# Altium project DM2097.PrjPcb (part 3 of 6)

## Sheet DM2097_LEFT_OV9282.SchDoc: =project_title
size Tabloid; PageSetup: Record=PageOptions|CenterHorizontal=True|CenterVertical=True|PrintScale=0.71|XCorrection=1.00|YCorrection=1.00|PrintKind=0|BorderSize=5000000|LeftOffset=0|BottomOffset=0|Orientation=2|PaperLength=1000|PaperWidth=1000|Scale=100|PaperSource=7|PrintQuality=-4|MediaType=1|DitherType=10|PrintScaleMode=1|PaperKind=A4; CompanyName: Luxonis Holding; DrawnBy: David Malovrh; Organization: Luxonis Holding; Address1: 1925 Harmony Park Drive; Address2: Westminster, CO; Address3: 80234; Address4: United States; DocumentNumber: D0000200; Revision: R3M1E4; SheetNumber: 5; SheetTotal: 17
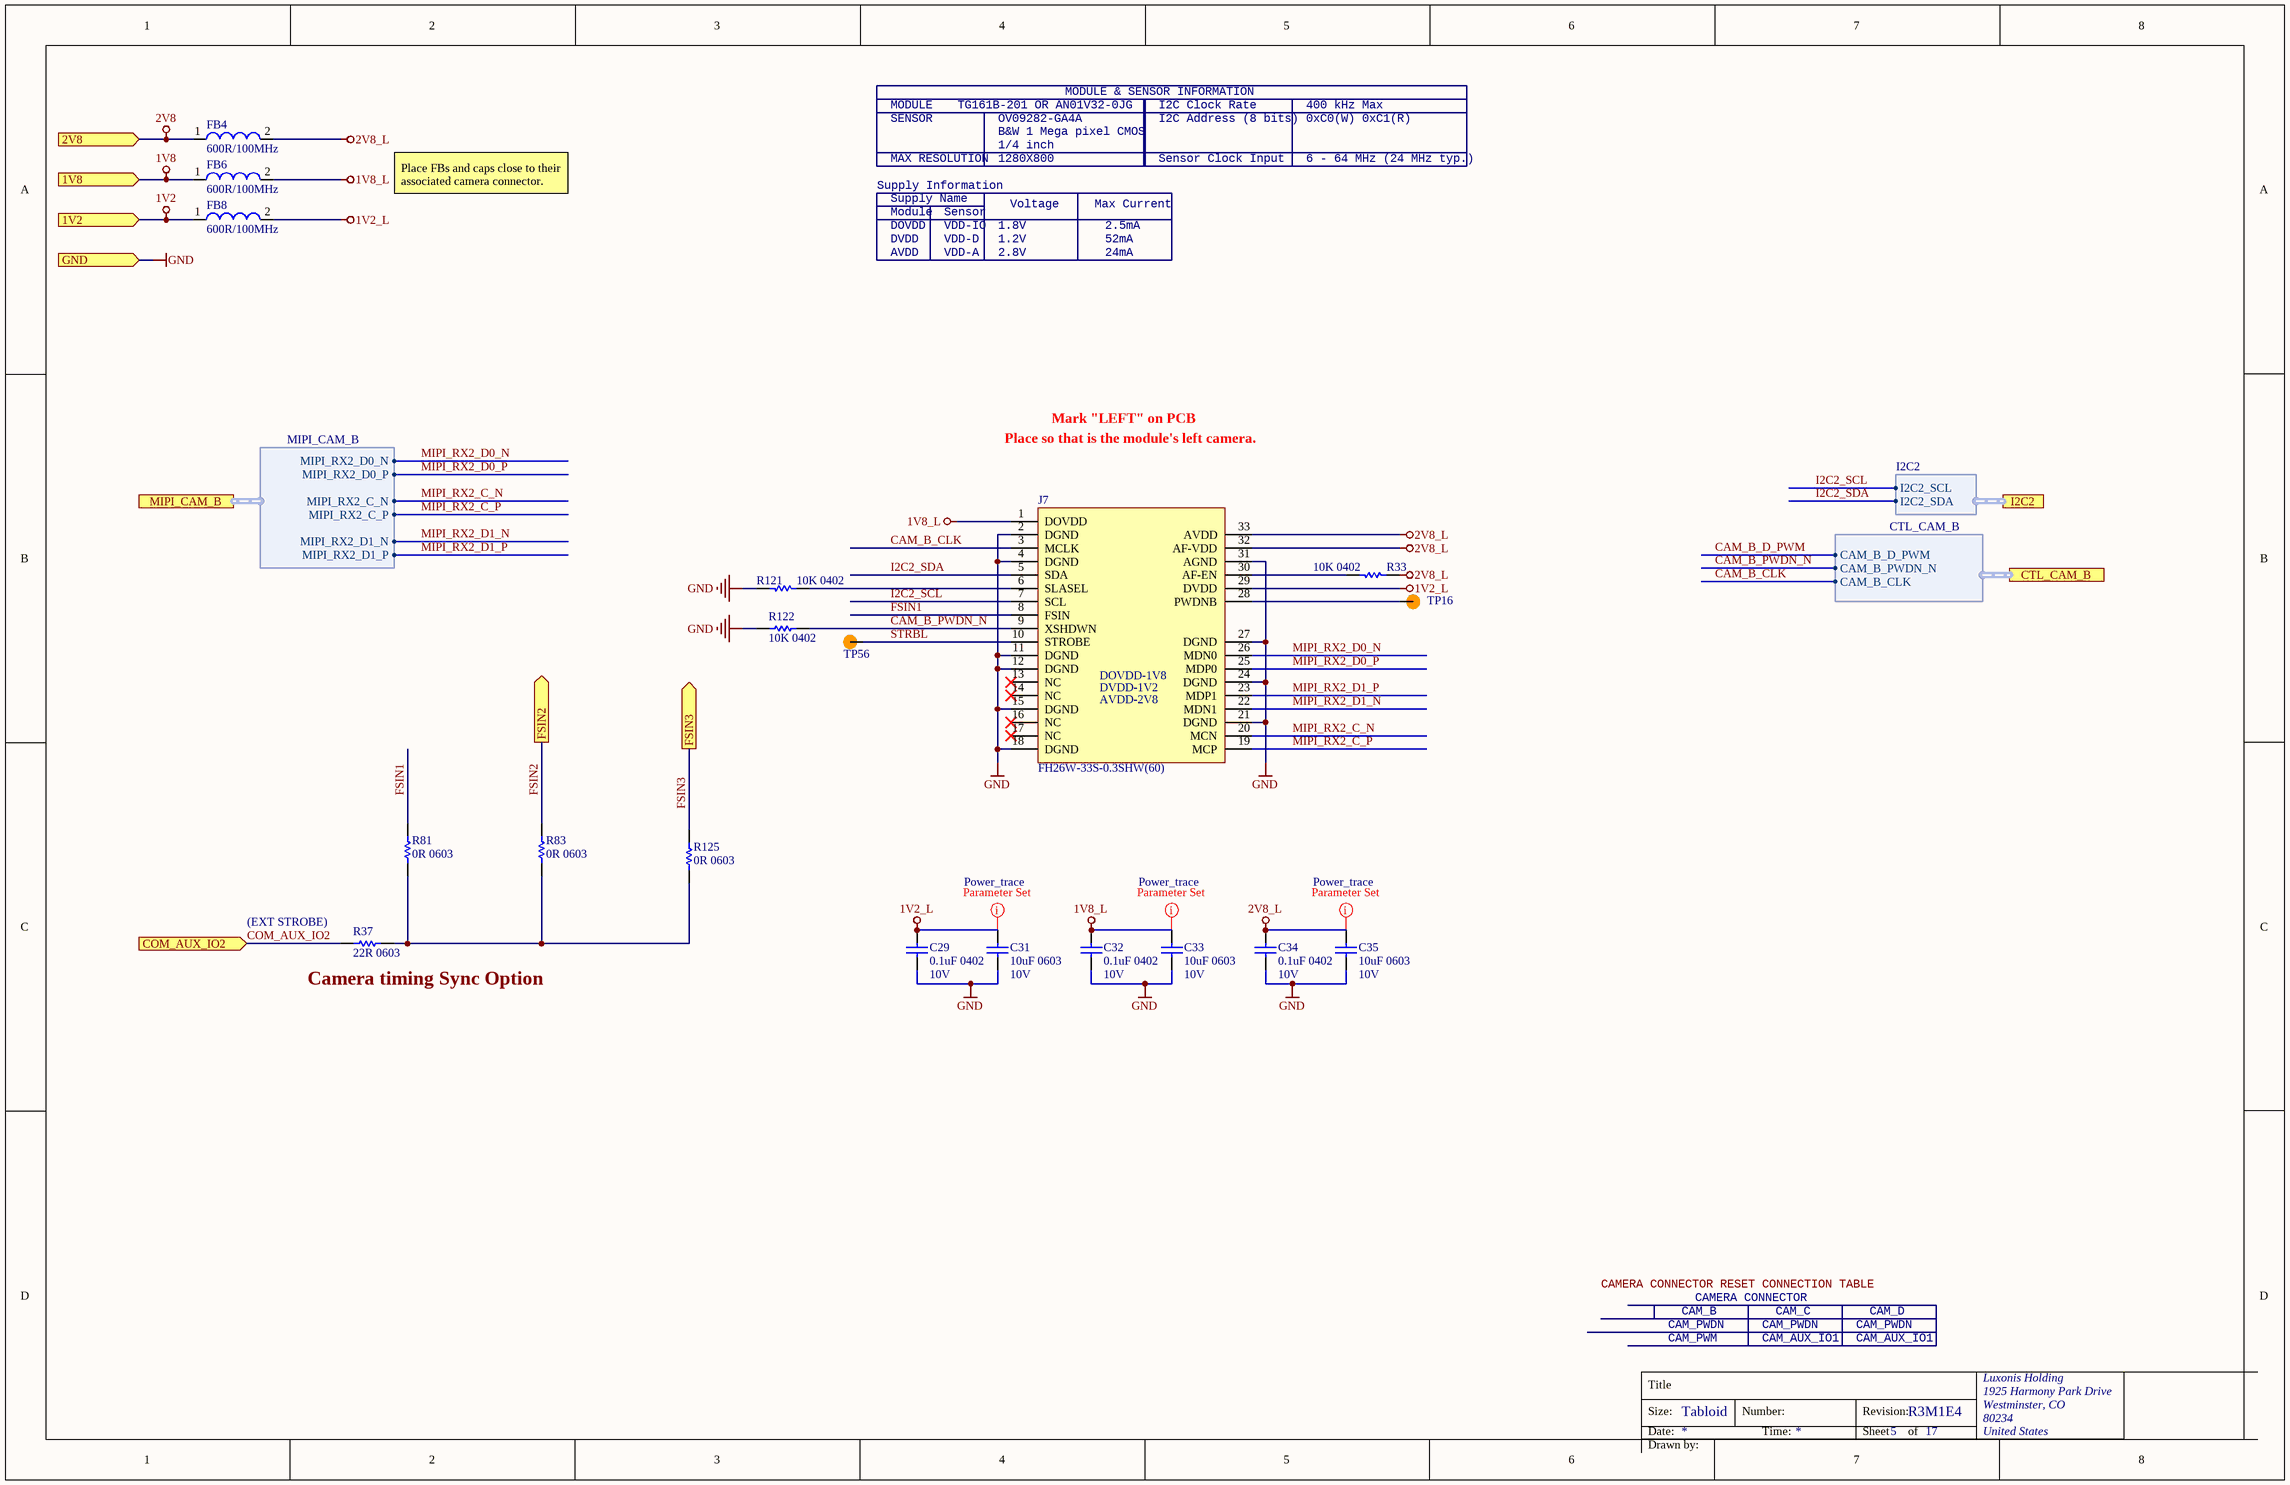
[diagram p3: DM2097_LEFT_OV9282.SchDoc]

### Parts
C29  0.1uF 0402  Voltage Rating: 10V  [CAPC0402(1005)70_N]
C31  10uF 0603  Voltage Rating: 10V  [CAPC0603(1608)100_N]
C32  0.1uF 0402  Voltage Rating: 10V  [CAPC0402(1005)70_N]
C33  10uF 0603  Voltage Rating: 10V  [CAPC0603(1608)100_N]
C34  0.1uF 0402  Voltage Rating: 10V  [CAPC0402(1005)70_N]
C35  10uF 0603  Voltage Rating: 10V  [CAPC0603(1608)100_N]
FB4  600R/100MHz  [2508056017Y2]
FB6  600R/100MHz  [2508056017Y2]
FB8  600R/100MHz  [2508056017Y2]
J7  FH26W-33S-0.3SHW(60)  [AC-PY003-OV9282]
R33  10K 0402  [RESC0402(1005)_L]
R37  22R 0603  [RESC0603(1608)_N]
R81  0R 0603  [RESC0603(1608)_N]
R83  0R 0603  [RESC0603(1608)_N]
R121  10K 0402  [RESC0402(1005)_L]
R122  10K 0402  [RESC0402(1005)_L]
R125  0R 0603  [RESC0603(1608)_N]
TP16  TP100_200_NS  [TP100_200_NS]  (value not drawn)  (no BOM)
TP56  TP100_200_NS  [TP100_200_NS]  (value not drawn)  (no BOM)

### Ports
1V2 (in), 1V8 (in), 2V8 (in), COM_AUX_IO2 (in), CTL_CAM_B (harness CTL_CAM_B), FSIN2 (out), FSIN3 (out), GND (in), I2C2 (harness I2C2), MIPI_CAM_B (harness MIPI_CAM_B)

### Harnesses
I2C2: I2C2_SDA, I2C2_SCL
MIPI_CAM_B: MIPI_RX2_D1_P, MIPI_RX2_D1_N, MIPI_RX2_D0_N, MIPI_RX2_D0_P, MIPI_RX2_C_N, MIPI_RX2_C_P
CTL_CAM_B: CAM_B_CLK, CAM_B_PWDN_N, CAM_B_D_PWM

### Nets
1V2: FB8.1 ; port 1V2
1V2_L: C29.2 C31.2 FB8.2 J7.29(DVDD)
1V8: FB6.1 ; port 1V8
1V8_L: C32.2 C33.2 FB6.2 J7.1(DOVDD)
2V8: FB4.1 ; port 2V8
2V8_L: C34.2 C35.2 FB4.2 J7.32(AF-VDD) J7.33(AVDD) R33.2
GND: C29.1 C31.1 C32.1 C33.1 C34.1 C35.1 J7.2(DGND) J7.4(DGND) J7.11(DGND) J7.12(DGND) J7.15(DGND) J7.18(DGND) J7.21(DGND) J7.24(DGND) J7.27(DGND) J7.31(AGND) R121.1 R122.2 ; port GND
CAM_B_CLK: J7.3(MCLK) ; port CTL_CAM_B.CAM_B_CLK
CAM_B_PWDN_N: J7.9(XSHDWN) R122.1 ; port CTL_CAM_B.CAM_B_PWDN_N
COM_AUX_IO2: R37.1 ; port COM_AUX_IO2
FSIN1: J7.8(FSIN) R81.2
FSIN2: R83.2 ; port FSIN2
FSIN3: R125.2 ; port FSIN3
I2C2_SCL: J7.7(SCL) ; port I2C2.I2C2_SCL
I2C2_SDA: J7.5(SDA) ; port I2C2.I2C2_SDA
MIPI_RX2_C_N: J7.20(MCN) ; port MIPI_CAM_B.MIPI_RX2_C_N
MIPI_RX2_C_P: J7.19(MCP) ; port MIPI_CAM_B.MIPI_RX2_C_P
MIPI_RX2_D0_N: J7.26(MDN0) ; port MIPI_CAM_B.MIPI_RX2_D0_N
MIPI_RX2_D0_P: J7.25(MDP0) ; port MIPI_CAM_B.MIPI_RX2_D0_P
MIPI_RX2_D1_N: J7.22(MDN1) ; port MIPI_CAM_B.MIPI_RX2_D1_N
MIPI_RX2_D1_P: J7.23(MDP1) ; port MIPI_CAM_B.MIPI_RX2_D1_P
STRBL: J7.10(STROBE) TP56.1
NetJ7_6: J7.6(SLASEL) R121.2
NetJ7_28: J7.28(PWDNB) TP16.1
NetJ7_30: J7.30(AF-EN) R33.1
NetR37_2: R37.2 R81.1 R83.1 R125.1

Not connected (* = marked no-connect by the designer): J7 13(NC)* 14(NC)* 16(NC)* 17(NC)*

### Layout directives
net class Power_trace: 1V2_L, 1V8_L, 2V8_L

### Notes on the sheet
- MODULE & SENSOR INFORMATION
- SENSOR
- MODULE
- MAX RESOLUTION
- TG161B-201 OR AN01V32-0JG
- B&W 1 Mega pixel CMOS
- 1280X800
- OV09282-GA4A
- 1/4 inch
- I2C Address (8 bits)
- I2C Clock Rate
- Sensor Clock Input
- 400 kHz Max
- 6 - 64 MHz (24 MHz typ.)
- 0xC0(W) 0xC1(R)
- Place FBs and caps close to their associated camera connector.
- Supply Information
- DOVDD
- Supply Name
- Module
- VDD-IO
- Sensor
- 1.8V
- Voltage
- Max Current
- 2.5mA
- AVDD
- DVDD
- VDD-A
- VDD-D
- 2.8V
- 1.2V
- 24mA
- 52mA
- Mark "LEFT" on PCB
- Place so that is the module's left camera.
- (near R37) (EXT STROBE)
- (near R37) Camera timing Sync Option
- CAMERA CONNECTOR RESET CONNECTION TABLE
- CAMERA CONNECTOR
- CAM_PWDN
- CAM_PWM
- CAM_B
- CAM_AUX_IO1
- CAM_C
- CAM_D
- Title
- Size:
- Date:
- Tabloid
- Number:
- Time:
- Revision:
- Sheet
- of
- Drawn by:
- (in symbol AC_PY003-OV9282_CON) DOVDD-1V8; DVDD-1V2; AVDD-2V8

### Library data of the parts
C29 C32 C34 = GRM155R71A104JA01D: CAP CER 0.1UF 10V X7R 0402 5%; Manufacturer 1: Murata; Capacitance: 100nF; Manufacturer Part Number 1: GRM155R71A104JA01D; Supplier 1: Digi-Key; Stock 1: 1346709; Pricing 1: 1=0.10000, 10=0.02500, 100=0.01130, 500=0.00806, 1000=0.00633, 2500=0.00575, 5000=0.00529 (USD); RoHS: Yes; Mount: Surface Mount; Case/Package: 0402; Case Code (Imperial): 0402; Case Code (Metric): 1005; Min Operating Temperature: -55°C; Max Operating Temperature: 125°C; Tolerance: 5%; Packaging: Tape and Reel; Voltage Rating (DC): 10V; Dielectric: X7R; Package Quantity: 10000; Termination: SMD/SMT; Length: 1mm; Height: 0.5mm; Width: 0.02inch; Thickness: 0.022inch; Depth: 0.5mm; Radiation Hardening: No; Lead Free: Lead Free; ComponentLink1URL: https://datasheet.ciiva.com/5411/product-5411135.pdf?src-supplier=Mouser; ComponentLink1Description: https://datasheet.ciiva.com/5411/product-5411135.pdf?src-supplier=Mouser; ComponentLink2URL: https://datasheet.ciiva.com/11618/c02e-11618821.pdf?src-supplier=Avnet; ComponentLink2Description: https://datasheet.ciiva.com/11618/c02e-11618821.pdf?src-supplier=Avnet; Supplier Part Number 1: 490-10777-1-ND
C31 C33 C35 = GRM188R61A106ME69D: CAP CER 10UF 10V X5R 0603 20%; Manufacturer 1: Murata; Material: Ceramic; Manufacturer Part Number 1: GRM188R61A106ME69D; Supplier 1: Digi-Key; Stock 1: 2873098; Pricing 1: 1=0.21000, 10=0.14100, 100=0.07130, 500=0.04876, 1000=0.04313 (USD); RoHS: Yes; Mount: Surface Mount; Case/Package: 0603; Weight: 0.000222oz; Case Code (Metric): 1608; Case Code (Imperial): 0603; Min Operating Temperature: -55°C; Max Operating Temperature: 85°C; Packaging: Tape and Reel; Tolerance: 20%; Capacitance: 10uF; Dielectric: X5R; Voltage Rating (DC): 10V; Package Quantity: 4000; Termination: SMD/SMT; Length: 1.6mm; Height: 0.8mm; Width: 0.8mm; Thickness: 0.035inch; Depth: 0.8mm; REACH SVHC: Unknown; Lead Free: Lead Free; ComponentLink1URL: http://www.mouser.com/ds/2/281/c02e-2905.pdf?src-supplier=Mouser; ComponentLink1Description: http://www.mouser.com/ds/2/281/c02e-2905.pdf?src-supplier=Mouser; ComponentLink2URL: http://components.arrow.com/part/dataview/0323_06119472?src-supplier=Arrow+Europe; ComponentLink2Description: http://components.arrow.com/part/dataview/0323_06119472?src-supplier=Arrow+Europe; ComponentLink3URL: http://www.farnell.com/datasheets/2048014.pdf?src-supplier=Farnell; ComponentLink3Description: http://www.farnell.com/datasheets/2048014.pdf?src-supplier=Farnell; ComponentLink4URL: http://www.farnell.com/datasheets/1872210.pdf?src-supplier=Farnell; ComponentLink4Description: http://www.farnell.com/datasheets/1872210.pdf?src-supplier=Farnell; ComponentLink5URL: http://search.murata.co.jp/Ceramy/image/img/A01X/G101/ENG/GRM188R61A106ME69-01.pdf?src-supplier=Digi-Key; ComponentLink5Description: http://search.murata.co.jp/Ceramy/image/img/A01X/G101/ENG/GRM188R61A106ME69-01.pdf?src-supplier=Digi-Key; ComponentLink6URL: http://www.farnell.com/datasheets/1872210.pdf?src-supplier=Newark; ComponentLink6Description: http://www.farnell.com/datasheets/1872210.pdf?src-supplier=Newark; ComponentLink7URL: http://www.farnell.com/datasheets/2048014.pdf?src-supplier=Element14; ComponentLink7Description: http://www.farnell.com/datasheets/2048014.pdf?src-supplier=Element14; ComponentLink8URL: http://www.farnell.com/datasheets/2048014.pdf?src-supplier=Newark; ComponentLink8Description: http://www.farnell.com/datasheets/2048014.pdf?src-supplier=Newark; Supplier Part Number 1: 490-10475-1-ND
FB4 FB6 FB8 = 2508056017Y2: FERRITE BEAD, 0.1OHM, 2A, 0805, 600R/100MHz; Manufacturer 1: Fair-Rite; Impedance: 600R; Tolerance: 25%; Resistance: 350mR; DC Resistance (DCR): 100mR; Test Frequency: 100MHz; Manufacturer Part Number 1: 2508056017Y2; Supplier 1: Digi-Key; Stock 1: 100491; Pricing 1: 1=0.10000, 10=0.07900, 25=0.07120, 50=0.05240, 100=0.04520, 250=0.03568, 500=0.03014, 1000=0.02538 (USD); RoHS: Yes; Case/Package: 0805; Number of Pins: 2; Case Code (Metric): 2012; Case Code (Imperial): 0805; Min Operating Temperature: -55°C; Max Operating Temperature: 125°C; Package Quantity: 4000; Packaging: Tape and Reel; Max DC Current: 2A; Termination: SMD/SMT; Military Standard: Not; DC Current: 2A; Current Rating: 2A; Frequency: 100MHz; Length: 2mm; Height: 0.9mm; Width: 1.25mm; Depth: 1.25mm; Radiation Hardening: No; REACH SVHC: No SVHC; ComponentLink1URL: https://datasheet.ciiva.com/3854/3802508056017y2-3854245.pdf?src-supplier=Arrow; ComponentLink1Description: https://datasheet.ciiva.com/3854/3802508056017y2-3854245.pdf?src-supplier=Arrow; ComponentLink2URL: https://datasheet.ciiva.com/22735/652149-22735047.pdf?src-supplier=Element14; ComponentLink2Description: https://datasheet.ciiva.com/22735/652149-22735047.pdf?src-supplier=Element14; ComponentLink3URL: https://datasheet.ciiva.com/1127/26143-1127514.pdf?src-supplier=Farnell; ComponentLink3Description: https://datasheet.ciiva.com/1127/26143-1127514.pdf?src-supplier=Farnell; ComponentLink4URL: https://datasheet.ciiva.com/18090/getdatasheetpartid-212640-18090187.pdf?src-supplier=Verical; ComponentLink4Description: https://datasheet.ciiva.com/18090/getdatasheetpartid-212640-18090187.pdf?src-supplier=Verical; ComponentLink5URL: https://datasheet.ciiva.com/7620/26143-7620140.pdf?src-supplier=Element14; ComponentLink5Description: https://datasheet.ciiva.com/7620/26143-7620140.pdf?src-supplier=Element14; Supplier Part Number 1: 1934-1487-1-ND
J7 = AC_PY003-OV9282_CON: FFC/FPC Connector, 33 Contact(s), 1 Row(s), Female, Right Angle, Surface Mount Terminal; Manufacturer 1: Hirose; Supplier 1: Digi-Key; Manufacturer Part Number 1: FH26W-33S-0.3SHW(60); RoHS: Yes; Category: FFC / FPC; Stock 1: 627; Pricing 1: 1=1,78000, 10=1,61700, 25=1,51800, 50=1,45200, 100=1,38600, 250=1,25400, 500=1,15500, 1000=0,99000, 2500=0,92400 (USD); ComponentLink1URL: https://datasheet.ciiva.com:443/pdfs/VipMasterIC/IC/HIRO/HIRO-S-A0007913874/HIRO-S-A0008593114-1.pdf?src-supplier=IHS+Markit; ComponentLink1Description: https://datasheet.ciiva.com:443/pdfs/VipMasterIC/IC/HIRO/HIRO-S-A0007913874/HIRO-S-A0008593114-1.pdf?src-supplier=IHS+Markit; ComponentLink2URL: https://www.hirose.com/product/en/download_file/key_name/FH26/category/Catalog/doc_file_id/49355/?file_category_id=4&item_id=298&is_series=1&src-supplier=Digi-Key; ComponentLink2Description: https://www.hirose.com/product/en/download_file/key_name/FH26/category/Catalog/doc_file_id/49355/?file_category_id=4&item_id=298&is_series=1&src-supplier=Digi-Key; ComponentLink3URL: https://www.hirose.com/product/download/?distributor=digikey&amp;type=2d&amp;lang=en&amp;num=FH26W-13S-0.3SHW(60)&src-supplier=Digi-Key; ComponentLink3Description: https://www.hirose.com/product/download/?distributor=digikey&amp;type=2d&amp;lang=en&amp;num=FH26W-13S-0.3SHW(60)&src-supplier=Digi-Key; Supplier Part Number 1: H125800CT-ND
R33 R121 R122 = RC0402FR-1310KL: RES SMD 10K OHM 1% 0402 1/16W Chip Resistor, 0402 [1005 Metric], 10 kohm, RC Series, 50 V, Thick Film, 62.5 mW; Manufacturer 1: Yageo; Resistance: 10kR; Temperature Coefficient: 100ppm/°C; Power Rating: 62.5mW; Voltage Rating: 50V; ComponentLink1URL: https://datasheet.ciiva.com/16940/pyu-rc0402-51-rohs-l-6-16940293.pdf?src-supplier=Avnet+Europe; ComponentLink1Description: https://datasheet.ciiva.com/16940/pyu-rc0402-51-rohs-l-6-16940293.pdf?src-supplier=Avnet+Europe; ComponentLink2URL: https://datasheet.ciiva.com/28386/pyu-rc0402-51-rohs-l-6-28386855.pdf?src-supplier=Avnet+Europe; ComponentLink2Description: https://datasheet.ciiva.com/28386/pyu-rc0402-51-rohs-l-6-28386855.pdf?src-supplier=Avnet+Europe; ComponentLink3URL: https://datasheet.ciiva.com/16740/pyu-rc0402-51-rohs-l-6-r-16740602.pdf?src-supplier=Future+Electronics; ComponentLink3Description: https://datasheet.ciiva.com/16740/pyu-rc0402-51-rohs-l-6-r-16740602.pdf?src-supplier=Future+Electronics; ComponentLink4URL: https://datasheet.ciiva.com/8891/pyu-rc0402-51-rohs-l-6-8891339.pdf?src-supplier=Avnet; ComponentLink4Description: https://datasheet.ciiva.com/8891/pyu-rc0402-51-rohs-l-6-8891339.pdf?src-supplier=Avnet; ComponentLink5URL: https://datasheet.ciiva.com/5557/pyu-rc0402-51-rohs-l-6-r-5557997.pdf?src-supplier=Mouser; ComponentLink5Description: https://datasheet.ciiva.com/5557/pyu-rc0402-51-rohs-l-6-r-5557997.pdf?src-supplier=Mouser; ComponentLink6URL: https://datasheet.ciiva.com/7983/1018594-7983533.pdf?src-supplier=Element14; ComponentLink6Description: https://datasheet.ciiva.com/7983/1018594-7983533.pdf?src-supplier=Element14; Supplier 1: Newark; Manufacturer Part Number 1: RC0402FR-1310KL; Stock 1: 62239; Pricing 1: 1=0.10000, 25=0.01200, 100=0.00400, 250=0.00400, 500=0.00300, 1000=0.00300 (USD); RoHS: Yes; Case/Package: 0402; Number of Pins: 2; Contact Plating: Tin,Matte,Lead; Case Code (Imperial): 0402; Case Code (Metric): 1005; Min Operating Temperature: -55°C; Max Operating Temperature: 155°C; Tolerance: 1%; Composition: Thick Film; Packaging: Tape and Reel; Termination: SMD/SMT; Military Standard: Not; Voltage Rating (DC): 50V; Working Voltage: 50V; Number of Terminations: 2; Length: 1mm; Depth: 0.5mm; Radiation Hardening: No; REACH SVHC: No SVHC; Lead Free: Lead Free; Supplier Part Number 1: 67R9960; Supplier 2: Future Electronics; Supplier 3: Mouser; Supplier 4: Element14; Supplier Part Number 2: RC0402FR-1310KL-CUTT; Supplier Part Number 3: 603-RC0402FR-1310KL; Supplier Part Number 4: 1799235
R37 = RC0603FR-0722RL: RES SMD 22 OHM 1% 1/10W 0603; Manufacturer 1: Yageo; Temperature Coefficient: 100ppm/°C; Power Rating: 100mW; Voltage Rating: 50V; Supplier 1: Digi-Key; Manufacturer Part Number 1: RC0603FR-0722RL; Stock 1: 3640176; Pricing 1: 1=0.10000, 10=0.02300, 100=0.00940, 1000=0.00421, 2500=0.00366 (USD); RoHS: Yes; Case/Package: 0603; Number of Pins: 2; Case Code (Metric): 1608; Case Code (Imperial): 0603; Min Operating Temperature: -55°C; Max Operating Temperature: 155°C; Tolerance: 1%; Resistance: 22R; Packaging: Tape and Reel; Composition: Thick Film; Voltage Rating (DC): 50V; Package Quantity: 1; Termination: SMD/SMT; Military Standard: Not; Number of Terminations: 2; Max Power Dissipation: 100mW; Features: Moisture Resistant; Length: 1.6mm; Height: 0.022inch; Width: 0.031inch; Depth: 0.8mm; REACH SVHC: No SVHC; Lead Free: Lead Free; ComponentLink1URL: https://datasheet.ciiva.com/11819/0900766b80f96399-11819285.pdf?src-supplier=RSComponents; ComponentLink1Description: https://datasheet.ciiva.com/11819/0900766b80f96399-11819285.pdf?src-supplier=RSComponents; ComponentLink2URL: https://datasheet.ciiva.com/2454/pyu-r-int-thick-7-2454354.pdf?src-supplier=Digi-Key; ComponentLink2Description: https://datasheet.ciiva.com/2454/pyu-r-int-thick-7-2454354.pdf?src-supplier=Digi-Key; ComponentLink3URL: https://datasheet.ciiva.com/2454/pyu-r-int-thick-7-2454355.pdf?src-supplier=Digi-Key; ComponentLink3Description: https://datasheet.ciiva.com/2454/pyu-r-int-thick-7-2454355.pdf?src-supplier=Digi-Key; ComponentLink4URL: https://datasheet.ciiva.com/2454/pyu-r-int-thick-7-2454356.pdf?src-supplier=Digi-Key; ComponentLink4Description: https://datasheet.ciiva.com/2454/pyu-r-int-thick-7-2454356.pdf?src-supplier=Digi-Key; ComponentLink5URL: https://datasheet.ciiva.com/46440/1868787-46440901.pdf?src-supplier=Element14; ComponentLink5Description: https://datasheet.ciiva.com/46440/1868787-46440901.pdf?src-supplier=Element14; ComponentLink6URL: https://datasheet.ciiva.com/46395/443971-46395032.pdf?src-supplier=Element14; ComponentLink6Description: https://datasheet.ciiva.com/46395/443971-46395032.pdf?src-supplier=Element14; Supplier 2: Newark; Supplier 3: Mouser; Supplier Part Number 2: 26M6754; Supplier Part Number 3: 603-RC0603FR-0722RL; Supplier Part Number 1: 311-22.0HRCT-ND
R81 R83 R125 = CRCW06030000Z0EA: RES SMD 0 OHM JUMPER 1/10W 0603 0 Ohms Jumper 0.1W, 1/10W Chip Resistor 0603 (1608 Metric) Automotive AEC-Q200 Thick Film; Manufacturer 1: Vishay; Manufacturer Part Number 1: CRCW0603-0000Z0EA; Resistance: 0mR; Power Rating: 100mW; Voltage Rating: 75V; Temperature Coefficient: 100ppm/°C; Tolerance: 5%; Current Rating: 2A; Supplier 1: Digi-Key; Stock 1: 742743; Pricing 1: 1=0.100000, 10=0.034000, 25=0.024400, 50=0.018600, 100=0.013800, 250=0.010480, 500=0.008400, 1000=0.006180 (USD); RoHS: Yes; Mount: Surface Mount; Case/Package: 0603; Weight: 7.1E-05oz; Contact Plating: Tin,Lead; Case Code (Metric): 1608; Case Code (Imperial): 0603; Min Operating Temperature: -55°C; Max Operating Temperature: 155°C; Composition: Thick Film; Termination: SMD/SMT; Packaging: Tape and Reel; Package Quantity: 1; Number of Terminations: 2; Military Standard: Not; Max Power Dissipation: 100mW; Voltage Rating (DC): 75V; Features: Automotive AEC-Q200; Working Voltage: 75V; Length: 1.55mm; Height: 0.02inch; Width: 0.033inch; Depth: 0.85mm; Radiation Hardening: No; Lead Free: Lead Free; REACH SVHC: Unknown; ComponentLink1URL: https://datasheet.ciiva.com/2461/dcrcwe3-2461968.pdf?src-supplier=Digi-Key; ComponentLink1Description: https://datasheet.ciiva.com/2461/dcrcwe3-2461968.pdf?src-supplier=Digi-Key; ComponentLink2URL: https://datasheet.ciiva.com/2461/dcrcwe3-2461969.pdf?src-supplier=Digi-Key; ComponentLink2Description: https://datasheet.ciiva.com/2461/dcrcwe3-2461969.pdf?src-supplier=Digi-Key; ComponentLink3URL: https://datasheet.ciiva.com/2461/dcrcwe3-2461970.pdf?src-supplier=Digi-Key; ComponentLink3Description: https://datasheet.ciiva.com/2461/dcrcwe3-2461970.pdf?src-supplier=Digi-Key; ComponentLink4URL: https://datasheet.ciiva.com/8340/dcrcwe3-8340197.pdf?src-supplier=Avnet; ComponentLink4Description: https://datasheet.ciiva.com/8340/dcrcwe3-8340197.pdf?src-supplier=Avnet; ComponentLink5URL: https://datasheet.ciiva.com/16941/dcrcw-16941302.pdf?src-supplier=Avnet+Europe; ComponentLink5Description: https://datasheet.ciiva.com/16941/dcrcw-16941302.pdf?src-supplier=Avnet+Europe; ComponentLink6URL: https://datasheet.ciiva.com/16199/dcrcwe3-16199063.pdf?src-supplier=Future+Electronics; ComponentLink6Description: https://datasheet.ciiva.com/16199/dcrcwe3-16199063.pdf?src-supplier=Future+Electronics; ComponentLink7URL: https://datasheet.ciiva.com/16725/70201119-16725175.pdf?src-supplier=Allied+Electronics; ComponentLink7Description: https://datasheet.ciiva.com/16725/70201119-16725175.pdf?src-supplier=Allied+Electronics; ComponentLink8URL: https://datasheet.ciiva.com/26316/fld-crcw-e3-data-en-26316615.pdf?src-supplier=Distrelec; ComponentLink8Description: https://datasheet.ciiva.com/26316/fld-crcw-e3-data-en-26316615.pdf?src-supplier=Distrelec; ComponentLink9URL: https://datasheet.ciiva.com/5544/dcrcwe3-109170-5544344.pdf?src-supplier=Mouser; ComponentLink9Description: https://datasheet.ciiva.com/5544/dcrcwe3-109170-5544344.pdf?src-supplier=Mouser; ComponentLink10URL: https://datasheet.ciiva.com/7841/1720486-7841816.pdf?src-supplier=Element14; ComponentLink10Description: https://datasheet.ciiva.com/7841/1720486-7841816.pdf?src-supplier=Element14; ComponentLink11URL: https://datasheet.ciiva.com/7841/1720486-7841817.pdf?src-supplier=Element14; ComponentLink11Description: https://datasheet.ciiva.com/7841/1720486-7841817.pdf?src-supplier=Element14; ComponentLink12URL: https://datasheet.ciiva.com/7841/125364-7841818.pdf?src-supplier=Element14; ComponentLink12Description: https://datasheet.ciiva.com/7841/125364-7841818.pdf?src-supplier=Element14; ComponentLink13URL: https://datasheet.ciiva.com/16721/70201119-16721450.pdf?src-supplier=Allied+Electronics; ComponentLink13Description: https://datasheet.ciiva.com/16721/70201119-16721450.pdf?src-supplier=Allied+Electronics; Supplier Part Number 1: 541-0.0GCT-ND
TP16 TP56 = TEST_POINT

## Sheet DM2097_Power_Supply.SchDoc: =project_title
size Tabloid; PageSetup: Record=PageOptions|CenterHorizontal=True|CenterVertical=True|PrintScale=0.73|XCorrection=1.00|YCorrection=1.00|PrintKind=0|BorderSize=5000000|LeftOffset=0|BottomOffset=0|Orientation=2|PaperLength=1000|PaperWidth=1000|Scale=100|PaperSource=7|PrintQuality=-4|MediaType=1|DitherType=10|PaperKind=A4|PrintScaleMode=1; CompanyName: Luxonis Holding; DrawnBy: David Malovrh; Organization: Luxonis Holding; Address1: 1925 Harmony Park Drive; Address2: Westminster, CO; Address3: 80234; Address4: United States; DocumentNumber: D0000200; Revision: R3M1E4; SheetNumber: 7; SheetTotal: 17
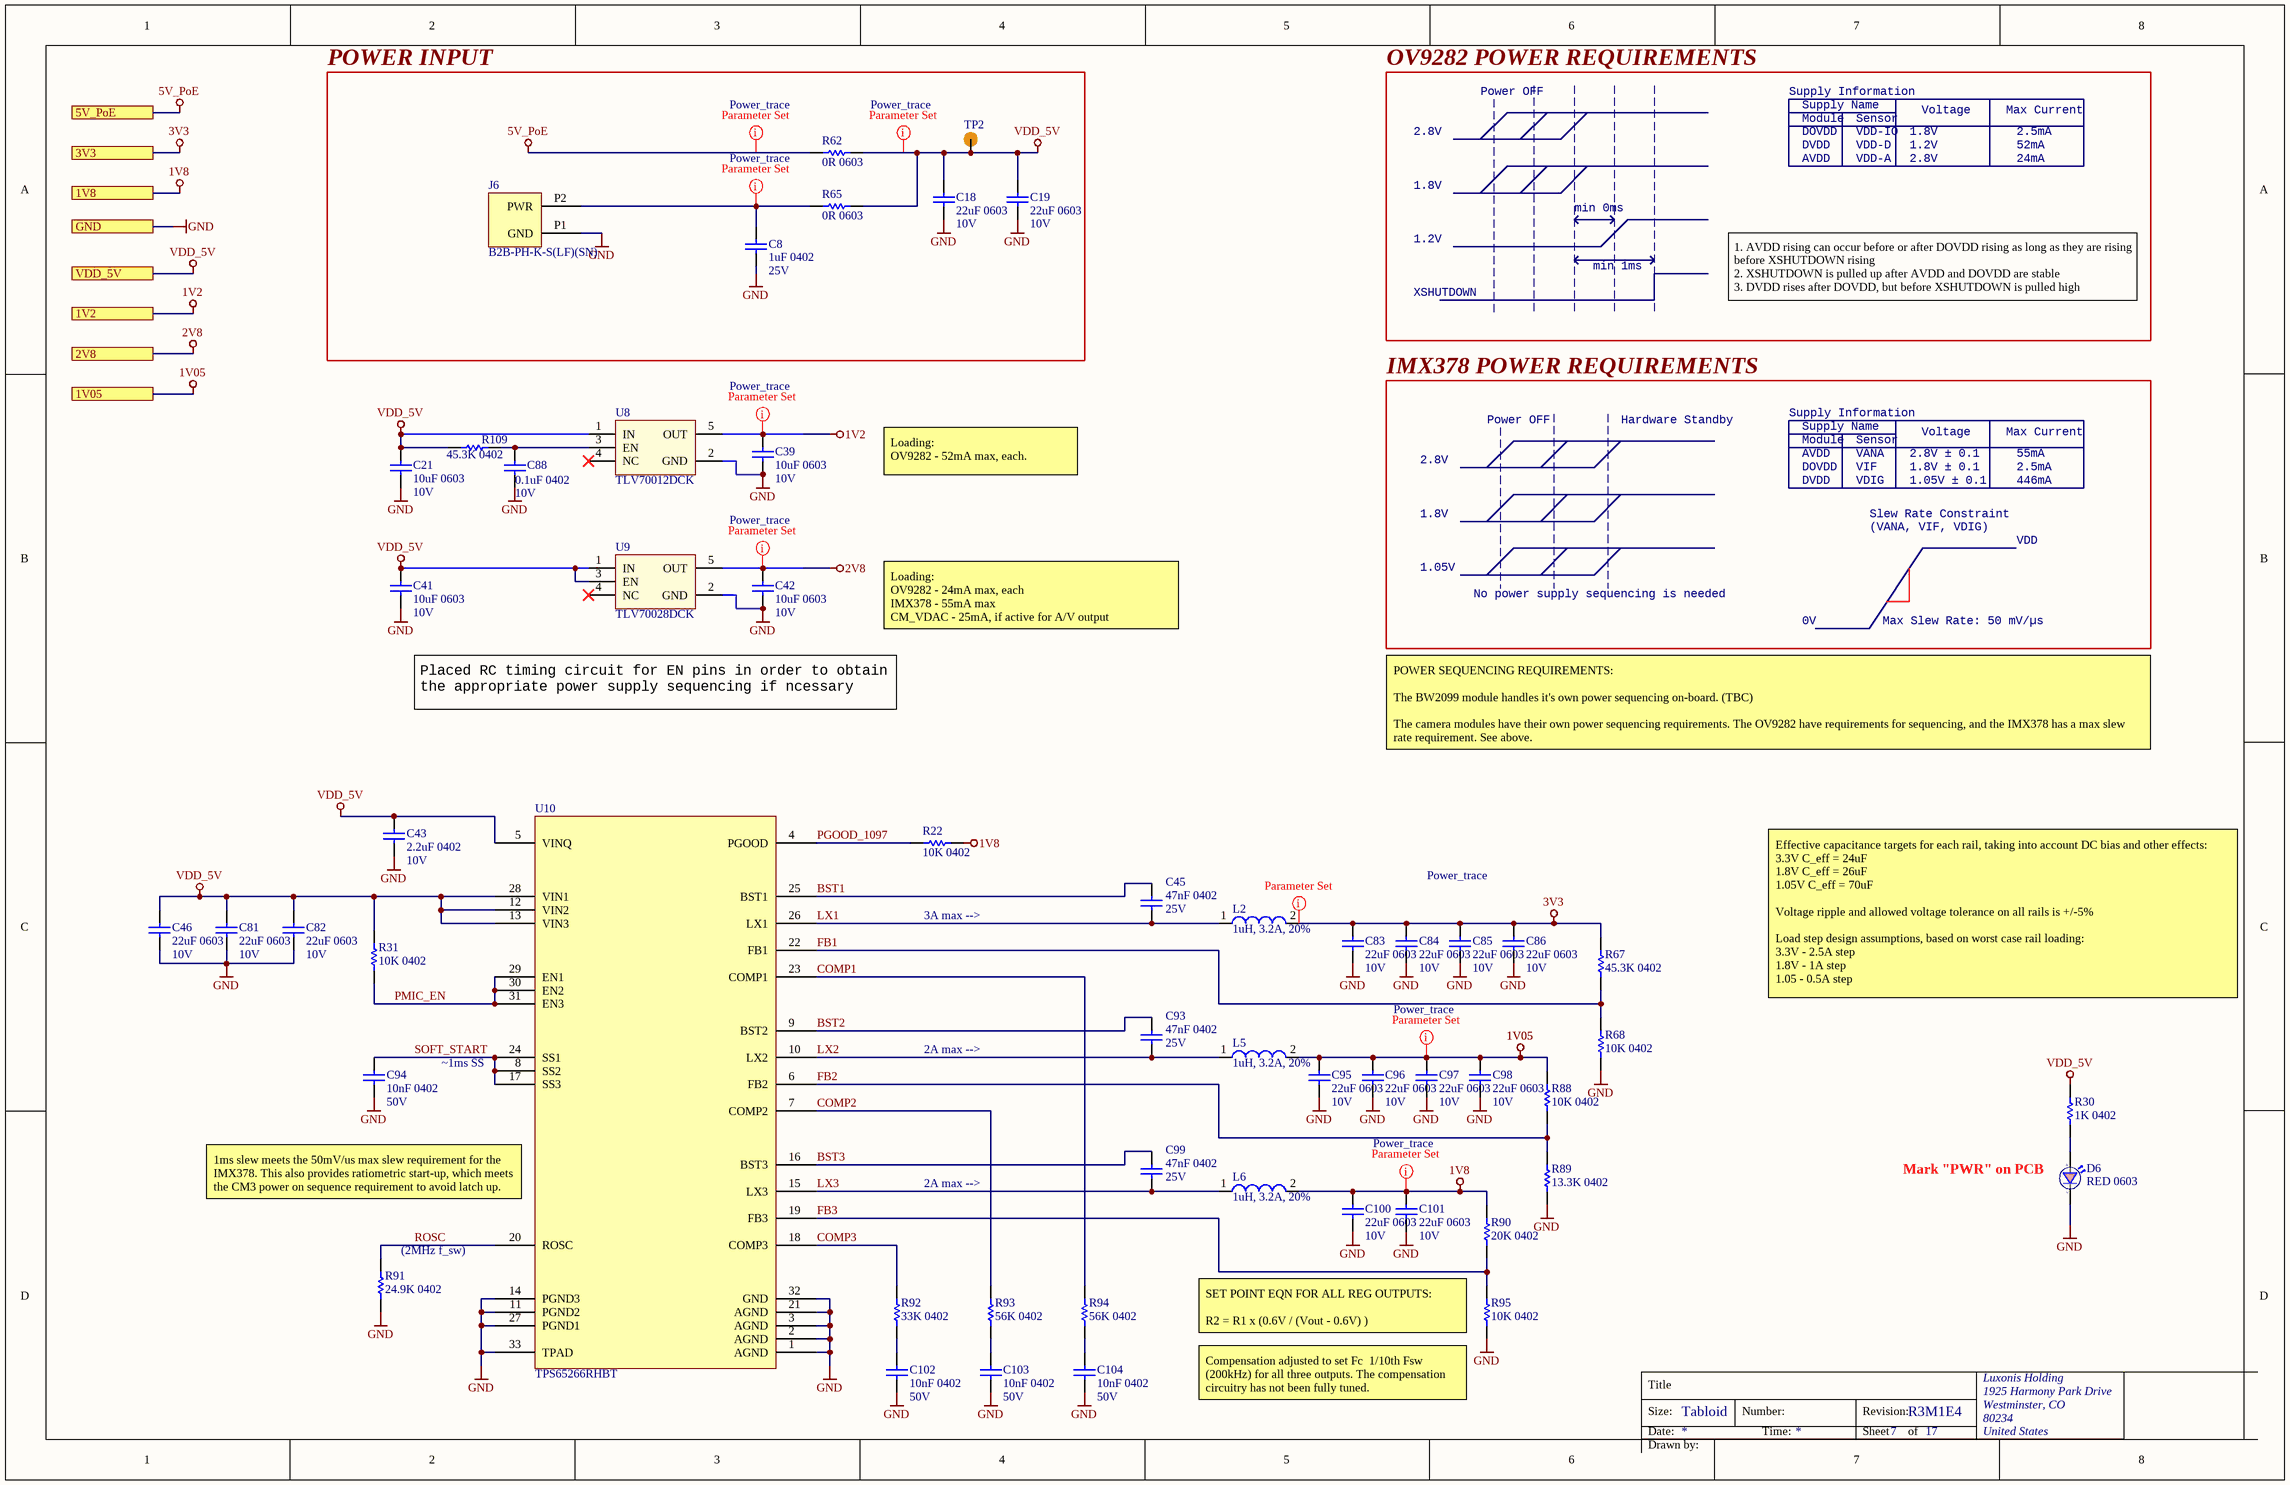
[diagram p4: DM2097_Power_Supply.SchDoc]

### Parts
C8  1uF 0402  Voltage Rating: 25V  [CAPC0402(1005)70_L]
C18  22uF 0603  Voltage Rating: 10V  [CAPC0603(1608)100_L]
C19  22uF 0603  Voltage Rating: 10V  [CAPC0603(1608)100_L]
C21  10uF 0603  Voltage Rating: 10V  [CAPC0603(1608)100_N]
C39  10uF 0603  Voltage Rating: 10V  [CAPC0603(1608)100_N]
C41  10uF 0603  Voltage Rating: 10V  [CAPC0603(1608)100_N]
C42  10uF 0603  Voltage Rating: 10V  [CAPC0603(1608)100_N]
C43  2.2uF 0402  Voltage Rating: 10V  [CAPC0402(1005)70_N]
C45  47nF 0402  Voltage: 25V  [CAPC0402(1005)70_N]
C46  22uF 0603  Voltage Rating: 10V  [CAPC0603(1608)100_N]
C81  22uF 0603  Voltage Rating: 10V  [CAPC0603(1608)100_N]
C82  22uF 0603  Voltage Rating: 10V  [CAPC0603(1608)100_N]
C83  22uF 0603  Voltage Rating: 10V  [CAPC0603(1608)100_N]
C84  22uF 0603  Voltage Rating: 10V  [CAPC0603(1608)100_N]
C85  22uF 0603  Voltage Rating: 10V  [CAPC0603(1608)100_N]
C86  22uF 0603  Voltage Rating: 10V  [CAPC0603(1608)100_N]
C88  0.1uF 0402  Voltage Rating: 10V  [CAPC0402(1005)70_L]
C93  47nF 0402  Voltage: 25V  [CAPC0402(1005)70_N]
C94  10nF 0402  Voltage Rating: 50V  [CAPC0402(1005)60_N]
C95  22uF 0603  Voltage Rating: 10V  [CAPC0603(1608)100_N]
C96  22uF 0603  Voltage Rating: 10V  [CAPC0603(1608)100_N]
C97  22uF 0603  Voltage Rating: 10V  [CAPC0603(1608)100_N]
C98  22uF 0603  Voltage Rating: 10V  [CAPC0603(1608)100_N]
C99  47nF 0402  Voltage: 25V  [CAPC0402(1005)70_N]
C100  22uF 0603  Voltage Rating: 10V  [CAPC0603(1608)100_N]
C101  22uF 0603  Voltage Rating: 10V  [CAPC0603(1608)100_N]
C102  10nF 0402  Voltage Rating: 50V  [CAPC0402(1005)60_N]
C103  10nF 0402  Voltage Rating: 50V  [CAPC0402(1005)60_N]
C104  10nF 0402  Voltage Rating: 50V  [CAPC0402(1005)60_N]
D6  RED 0603  [SML_D1xx8W]
J6  B2B-PH-K-S(LF)(SN)  [B2B-PH-K-S(LF)(SN)]
L2  1uH, 3.2A, 20%  [DFE252012P-1R0M=P2]
L5  1uH, 3.2A, 20%  [DFE252012P-1R0M=P2]
L6  1uH, 3.2A, 20%  [DFE252012P-1R0M=P2]
R22  10K 0402  [RESC0402(1005)_N]
R30  1K 0402  [RESC0402(1005)_N]
R31  10K 0402  [RESC0402(1005)_N]
R62  0R 0603  [RESC0603(1608)_N]
R65  0R 0603  [RESC0603(1608)_N]
R67  45.3K 0402  [RESC0402(1005)_N]
R68  10K 0402  [RESC0402(1005)_N]
R88  10K 0402  [RESC0402(1005)_N]
R89  13.3K 0402  [RESC0402(1005)_N]
R90  20K 0402  [RESC0402(1005)_N]
R91  24.9K 0402  [RESC0402(1005)_N]
R92  33K 0402  [RESC0402(1005)_N]
R93  56K 0402  [RESC0402(1005)_N]
R94  56K 0402  [RESC0402(1005)_N]
R95  10K 0402  [RESC0402(1005)_N]
R109  45.3K 0402  [RESC0402(1005)_L]
TP2  TP100_200_NS  [TP100_200_NS]  (value not drawn)  (no BOM)
U8  TLV70012DCK  [TLV70012DCK]
U9  TLV70028DCK  [TLV70028DCK]
U10  TPS65266RHBT  [TPS65266RHBT]

### Blocks framed on the sheet
POWER INPUT: C8 C18 C19 J6 R62 R65 TP2

### Ports
1V2, 1V05, 1V8, 2V8, 3V3, 5V_PoE, GND, VDD_5V

### Nets
1V2: C39.2 U8.5(OUT) ; port 1V2
1V05: C95.1 C96.1 C97.1 C98.1 L5.2 R88.2 ; port 1V05
1V8: C100.1 C101.1 L6.2 R22.2 R90.2 ; port 1V8
2V8: C42.2 U9.5(OUT) ; port 2V8
3V3: C83.1 C84.1 C85.1 C86.1 L2.2 R67.2 ; port 3V3
5V_PoE: R62.1 ; port 5V_PoE
GND: C8.1 C18.1 C19.1 C21.1 C39.1 C41.1 C42.1 C43.2 C46.2 C81.2 C82.2 C83.2 C84.2 C85.2 C86.2 C88.1 C94.2 C95.2 C96.2 C97.2 C98.2 C100.2 C101.2 C102.2 C103.2 C104.2 D6.1(C) J6.P1(GND) R68.1 R89.1 R91.1 R95.1 U8.2(GND) U9.2(GND) U10.1(AGND) U10.2(AGND) U10.3(AGND) U10.11(PGND2) U10.14(PGND3) U10.21(AGND) U10.27(PGND1) U10.32(GND) U10.33(TPAD) ; port GND
VDD_5V: C18.2 C19.2 C21.2 C41.2 C43.1 C46.1 C81.1 C82.1 R30.2 R31.2 R62.2 R65.2 R109.2 TP2.1 U8.1(IN) U9.1(IN) U9.3(EN) U10.5(VINQ) U10.12(VIN2) U10.13(VIN3) U10.28(VIN1) ; port VDD_5V
BST1: C45.1 U10.25(BST1)
BST2: C93.1 U10.9(BST2)
BST3: C99.1 U10.16(BST3)
COMP1: R94.2 U10.23(COMP1)
COMP2: R93.2 U10.7(COMP2)
COMP3: R92.2 U10.18(COMP3)
FB1: R67.1 R68.2 U10.22(FB1)
FB2: R88.1 R89.2 U10.6(FB2)
FB3: R90.1 R95.2 U10.19(FB3)
LX1: C45.2 L2.1 U10.26(LX1)
LX2: C93.2 L5.1 U10.10(LX2)
LX3: C99.2 L6.1 U10.15(LX3)
PGOOD_1097: R22.1 U10.4(PGOOD)
PMIC_EN: R31.1 U10.29(EN1) U10.30(EN2) U10.31(EN3)
ROSC: R91.2 U10.20(ROSC)
SOFT_START: C94.1 U10.8(SS2) U10.17(SS3) U10.24(SS1)
NetC8_2: C8.2 J6.P2(PWR) R65.1
NetC88_2: C88.2 R109.1 U8.3(EN)
NetC102_1: C102.1 R92.1
NetC103_1: C103.1 R93.1
NetC104_1: C104.1 R94.1
NetD6_2: D6.2(A) R30.1

Not connected (* = marked no-connect by the designer): U8 4(NC)*; U9 4(NC)*

### Layout directives
net class Power_trace: 1V2, 1V05, 1V8, 2V8, 3V3, 5V_PoE, NetC8_2, VDD_5V

### Notes on the sheet
- OV9282 POWER REQUIREMENTS
- Power OFF
- Supply Information
- 2.8V
- AVDD
- DOVDD
- DVDD
- Supply Name
- Module
- VDD-A
- VDD-IO
- VDD-D
- Sensor
- 1.8V
- 1.2V
- Voltage
- Max Current
- 24mA
- 2.5mA
- 52mA
- min 0ms
- XSHUTDOWN
- min 1ms
- 1. AVDD rising can occur before or after DOVDD rising as long as they are rising before XSHUTDOWN rising
  2. XSHUTDOWN is pulled up after AVDD and DOVDD are stable
  3. DVDD rises after DOVDD, but before XSHUTDOWN is pulled high
- IMX378 POWER REQUIREMENTS
- Hardware Standby
- Loading:
  OV9282 - 52mA max, each.
- VANA
- VIF
- VDIG
- 2.8V ± 0.1
- 1.8V ± 0.1
- 1.05V ± 0.1
- 55mA
- 446mA
- 1.05V
- Slew Rate Constraint
- (VANA, VIF, VDIG)
- VDD
- Loading:
  OV9282 - 24mA max, each
  IMX378 - 55mA max
  CM_VDAC - 25mA, if active for A/V output
- No power supply sequencing is needed
- 0V
- Max Slew Rate: 50 mV/µs
- Placed RC timing circuit for EN pins in order to obtain the appropriate power supply sequencing if ncessary
- POWER SEQUENCING REQUIREMENTS:
  The BW2099 module handles it's own power sequencing on-board. (TBC)
  The camera modules have their own power sequencing requirements. The OV9282 have requirements for sequencing, and the IMX378 has a max slew rate requirement. See above.
- 3A max -->
- Effective capacitance targets for each rail, taking into account DC bias and other effects:
  3.3V C_eff = 24uF
  1.8V C_eff = 26uF
  1.05V C_eff = 70uF
  Voltage ripple and allowed voltage tolerance on all rails is +/-5%
  Load step design assumptions, based on worst case rail loading:
  3.3V - 2.5A step
  1.8V - 1A step
  1.05 - 0.5A step
- ~1ms SS
- 2A max -->
- (near U10) 1ms slew meets the 50mV/us max slew requirement for the IMX378. This also provides ratiometric start-up, which meets the CM3 power on sequence requirement to avoid latch up.
- Mark "PWR" on PCB
- (near R91) (2MHz f_sw)
- (near R95) SET POINT EQN FOR ALL REG OUTPUTS:
  R2 = R1 x (0.6V / (Vout - 0.6V) )
- (near R95) Compensation adjusted to set Fc  1/10th Fsw  (200kHz) for all three outputs. The compensation circuitry has not been fully tuned.
- Title
- Size:
- Date:
- Tabloid
- Number:
- Time:
- Revision:
- Sheet
- of
- Drawn by: